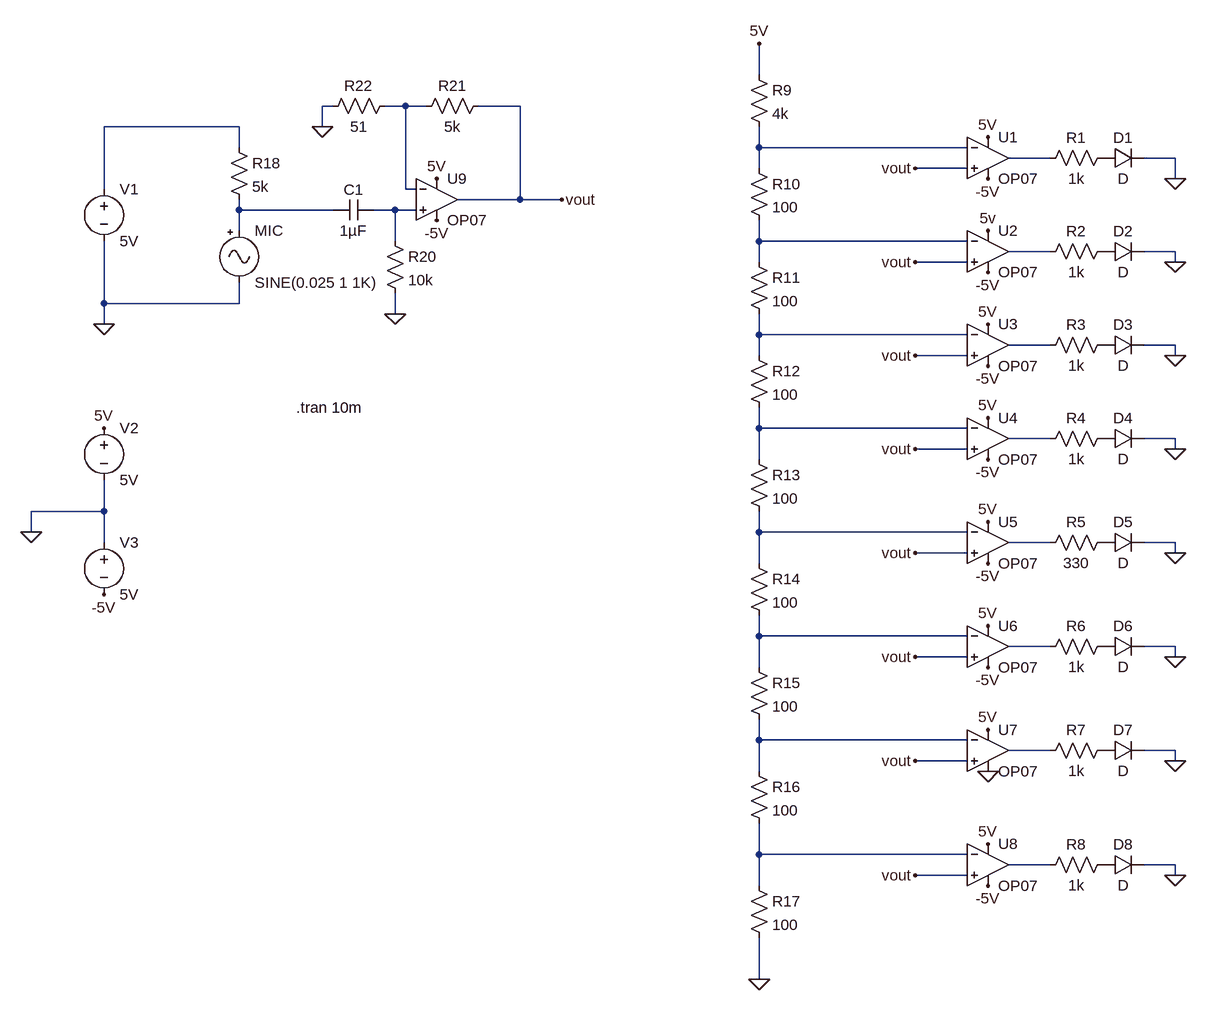
[diagram p0: schematic Project 1 - MIC.asc]
Project 1 - MIC.asc, the LTspice schematic file:
Version 4
SHEET 1 880 680
WIRE -272 -1120 -272 -1168
WIRE -928 -1072 -944 -1072
WIRE -816 -1072 -848 -1072
WIRE -784 -1072 -816 -1072
WIRE -640 -1072 -704 -1072
WIRE -1072 -1040 -1280 -1040
WIRE -944 -1040 -944 -1072
WIRE -1072 -1008 -1072 -1040
WIRE -272 -1008 -272 -1040
WIRE 48 -1008 -272 -1008
WIRE 176 -992 112 -992
WIRE 368 -992 320 -992
WIRE -272 -976 -272 -1008
WIRE 48 -976 -32 -976
WIRE 368 -960 368 -992
WIRE -1280 -944 -1280 -1040
WIRE -816 -944 -816 -1072
WIRE -800 -944 -816 -944
WIRE -640 -928 -640 -1072
WIRE -640 -928 -736 -928
WIRE -576 -928 -640 -928
WIRE -1072 -912 -1072 -928
WIRE -928 -912 -1072 -912
WIRE -832 -912 -864 -912
WIRE -800 -912 -832 -912
WIRE -1072 -880 -1072 -912
WIRE -832 -864 -832 -912
WIRE -272 -864 -272 -896
WIRE 48 -864 -272 -864
WIRE 176 -848 112 -848
WIRE 368 -848 320 -848
WIRE -272 -832 -272 -864
WIRE 48 -832 -32 -832
WIRE 368 -832 368 -848
WIRE -1280 -768 -1280 -864
WIRE -1072 -768 -1072 -800
WIRE -1072 -768 -1280 -768
WIRE -832 -752 -832 -784
WIRE -1280 -736 -1280 -768
WIRE -272 -720 -272 -752
WIRE 48 -720 -272 -720
WIRE 176 -704 112 -704
WIRE 368 -704 320 -704
WIRE -272 -688 -272 -720
WIRE 48 -688 -32 -688
WIRE 368 -688 368 -704
WIRE -272 -576 -272 -608
WIRE 48 -576 -272 -576
WIRE 176 -560 112 -560
WIRE 368 -560 320 -560
WIRE 48 -544 -32 -544
WIRE 368 -544 368 -560
WIRE -272 -528 -272 -576
WIRE -1280 -448 -1280 -496
WIRE -1280 -448 -1392 -448
WIRE -1392 -416 -1392 -448
WIRE -272 -416 -272 -448
WIRE 48 -416 -272 -416
WIRE -1280 -400 -1280 -448
WIRE 176 -400 112 -400
WIRE 368 -400 320 -400
WIRE 48 -384 -32 -384
WIRE 368 -384 368 -400
WIRE -272 -368 -272 -416
WIRE -272 -256 -272 -288
WIRE 48 -256 -272 -256
WIRE 176 -240 112 -240
WIRE 368 -240 320 -240
WIRE 48 -224 -32 -224
WIRE 368 -224 368 -240
WIRE -272 -208 -272 -256
WIRE -272 -96 -272 -128
WIRE 48 -96 -272 -96
WIRE 176 -80 112 -80
WIRE 368 -80 320 -80
WIRE 48 -64 -32 -64
WIRE 368 -64 368 -80
WIRE -272 -48 -272 -96
WIRE -272 80 -272 32
WIRE 48 80 -272 80
WIRE 176 96 112 96
WIRE 368 96 320 96
WIRE 48 112 -32 112
WIRE 368 112 368 96
WIRE -272 128 -272 80
WIRE -272 272 -272 208
FLAG 368 -960 0
FLAG 368 -832 0
FLAG 368 -688 0
FLAG 368 -544 0
FLAG 368 -384 0
FLAG 368 -224 0
FLAG 368 -64 0
FLAG 368 112 0
FLAG -272 272 0
FLAG -272 -1168 5V
FLAG 80 -1024 5V
FLAG 80 -880 5v
FLAG 80 -736 5V
FLAG 80 -592 5V
FLAG 80 -432 5V
FLAG 80 -272 5V
FLAG 80 -112 5V
FLAG 80 64 5V
FLAG 80 -960 -5V
FLAG 80 -816 -5V
FLAG 80 -672 -5V
FLAG 80 -528 -5V
FLAG 80 -368 -5V
FLAG 80 -208 -5V
FLAG 80 -48 0
FLAG 80 128 -5V
FLAG -32 -976 vout
FLAG -832 -752 0
FLAG -944 -1040 0
FLAG -576 -928 vout
FLAG -768 -960 5V
FLAG -768 -896 -5V
FLAG -1280 -736 0
FLAG -1280 -576 5V
FLAG -1280 -320 -5V
FLAG -1392 -416 0
FLAG -32 -832 vout
FLAG -32 -688 vout
FLAG -32 -544 vout
FLAG -32 -384 vout
FLAG -32 -224 vout
FLAG -32 -64 vout
FLAG -32 112 vout
SYMBOL OpAmps\\OP07 80 -1056 R0
SYMATTR InstName U1
SYMBOL OpAmps\\OP07 80 -912 R0
SYMATTR InstName U2
SYMBOL OpAmps\\OP07 80 -768 R0
SYMATTR InstName U3
SYMBOL OpAmps\\OP07 80 -624 R0
SYMATTR InstName U4
SYMBOL OpAmps\\OP07 80 -464 R0
SYMATTR InstName U5
SYMBOL OpAmps\\OP07 80 -304 R0
SYMATTR InstName U6
SYMBOL OpAmps\\OP07 80 -144 R0
SYMATTR InstName U7
SYMBOL OpAmps\\OP07 80 32 R0
SYMATTR InstName U8
SYMBOL res 272 -1008 R90
WINDOW 0 0 56 VBottom 2
WINDOW 3 32 56 VTop 2
SYMATTR InstName R1
SYMATTR Value 1k
SYMBOL res 272 -864 R90
WINDOW 0 0 56 VBottom 2
WINDOW 3 32 56 VTop 2
SYMATTR InstName R2
SYMATTR Value 1k
SYMBOL res 272 -720 R90
WINDOW 0 0 56 VBottom 2
WINDOW 3 32 56 VTop 2
SYMATTR InstName R3
SYMATTR Value 1k
SYMBOL res 272 -576 R90
WINDOW 0 0 56 VBottom 2
WINDOW 3 32 56 VTop 2
SYMATTR InstName R4
SYMATTR Value 1k
SYMBOL res 272 -416 R90
WINDOW 0 0 56 VBottom 2
WINDOW 3 32 56 VTop 2
SYMATTR InstName R5
SYMATTR Value 330
SYMBOL res 272 -256 R90
WINDOW 0 0 56 VBottom 2
WINDOW 3 32 56 VTop 2
SYMATTR InstName R6
SYMATTR Value 1k
SYMBOL res 272 -96 R90
WINDOW 0 0 56 VBottom 2
WINDOW 3 32 56 VTop 2
SYMATTR InstName R7
SYMATTR Value 1k
SYMBOL res 272 80 R90
WINDOW 0 0 56 VBottom 2
WINDOW 3 32 56 VTop 2
SYMATTR InstName R8
SYMATTR Value 1k
SYMBOL diode 256 -976 R270
WINDOW 0 32 32 VTop 2
WINDOW 3 0 32 VBottom 2
SYMATTR InstName D1
SYMBOL diode 256 -832 R270
WINDOW 0 32 32 VTop 2
WINDOW 3 0 32 VBottom 2
SYMATTR InstName D2
SYMBOL diode 256 -688 R270
WINDOW 0 32 32 VTop 2
WINDOW 3 0 32 VBottom 2
SYMATTR InstName D3
SYMBOL diode 256 -544 R270
WINDOW 0 32 32 VTop 2
WINDOW 3 0 32 VBottom 2
SYMATTR InstName D4
SYMBOL diode 256 -384 R270
WINDOW 0 32 32 VTop 2
WINDOW 3 0 32 VBottom 2
SYMATTR InstName D5
SYMBOL diode 256 -224 R270
WINDOW 0 32 32 VTop 2
WINDOW 3 0 32 VBottom 2
SYMATTR InstName D6
SYMBOL diode 256 -64 R270
WINDOW 0 32 32 VTop 2
WINDOW 3 0 32 VBottom 2
SYMATTR InstName D7
SYMBOL diode 256 112 R270
WINDOW 0 32 32 VTop 2
WINDOW 3 0 32 VBottom 2
SYMATTR InstName D8
SYMBOL res -288 -1136 R0
SYMATTR InstName R9
SYMATTR Value 4k
SYMBOL res -288 -992 R0
SYMATTR InstName R10
SYMATTR Value 100
SYMBOL res -288 -848 R0
SYMATTR InstName R11
SYMATTR Value 100
SYMBOL res -288 -704 R0
SYMATTR InstName R12
SYMATTR Value 100
SYMBOL res -288 -544 R0
SYMATTR InstName R13
SYMATTR Value 100
SYMBOL res -288 -384 R0
SYMATTR InstName R14
SYMATTR Value 100
SYMBOL res -288 -224 R0
SYMATTR InstName R15
SYMATTR Value 100
SYMBOL res -288 -64 R0
SYMATTR InstName R16
SYMATTR Value 100
SYMBOL res -288 112 R0
SYMATTR InstName R17
SYMATTR Value 100
SYMBOL voltage -1280 -960 R0
WINDOW 123 24 44 Left 2
WINDOW 39 0 0 Left 0
SYMATTR InstName V1
SYMATTR Value 5V
SYMBOL res -1088 -1024 R0
SYMATTR InstName R18
SYMATTR Value 5k
SYMBOL cap -864 -928 R90
WINDOW 0 0 32 VBottom 2
WINDOW 3 32 32 VTop 2
SYMATTR InstName C1
SYMATTR Value 1µF
SYMBOL OpAmps\\OP07 -768 -992 R0
SYMATTR InstName U9
SYMBOL res -848 -880 R0
SYMATTR InstName R20
SYMATTR Value 10k
SYMBOL res -688 -1088 R90
WINDOW 0 0 56 VBottom 2
WINDOW 3 32 56 VTop 2
SYMATTR InstName R21
SYMATTR Value 5k
SYMBOL res -832 -1088 R90
WINDOW 0 0 56 VBottom 2
WINDOW 3 32 56 VTop 2
SYMATTR InstName R22
SYMATTR Value 51
SYMBOL voltage -1280 -592 R0
WINDOW 123 24 44 Left 2
WINDOW 39 0 0 Left 0
SYMATTR InstName V2
SYMATTR Value 5V
SYMBOL voltage -1280 -416 R0
WINDOW 123 24 44 Left 2
WINDOW 39 0 0 Left 0
SYMATTR InstName V3
SYMATTR Value 5V
SYMBOL Misc\\signal -1072 -896 R0
SYMATTR InstName MIC
SYMATTR Value SINE(0.025 1 1K)
TEXT -984 -608 Left 2 !.tran 10m

The netlist it stands for:
* Project 1 - MIC.asc
XU1 vout N003 5V -5V N004 LT1001  ; OP07, pins In+ In- V+ V- OUT
XU2 vout N007 5V -5V N008 LT1001  ; OP07, pins In+ In- V+ V- OUT
XU3 vout N009 5V -5V N010 LT1001  ; OP07, pins In+ In- V+ V- OUT
XU4 vout N011 5V -5V N012 LT1001  ; OP07, pins In+ In- V+ V- OUT
XU5 vout N013 5V -5V N014 LT1001  ; OP07, pins In+ In- V+ V- OUT
XU6 vout N015 5V -5V N016 LT1001  ; OP07, pins In+ In- V+ V- OUT
XU7 vout N017 5V 0 N018 LT1001  ; OP07, pins In+ In- V+ V- OUT
XU8 vout N019 5V -5V N020 LT1001  ; OP07, pins In+ In- V+ V- OUT
R1 P001 N004 1k
R2 P002 N008 1k
R3 P003 N010 1k
R4 P004 N012 1k
R5 P005 N014 330
R6 P006 N016 1k
R7 P007 N018 1k
R8 P008 N020 1k
D1 P001 0 D
D2 P002 0 D
D3 P003 0 D
D4 P004 0 D
D5 P005 0 D
D6 P006 0 D
D7 P007 0 D
D8 P008 0 D
R9 5V N003 4k
R10 N003 N007 100
R11 N007 N009 100
R12 N009 N011 100
R13 N011 N013 100
R14 N013 N015 100
R15 N015 N017 100
R16 N017 N019 100
R17 N019 0 100
V1 N002 0 5V
R18 N002 N005 5k
C1 N006 N005 1µF
XU9 N006 N001 5V -5V vout LT1001  ; OP07, pins In+ In- V+ V- OUT
R20 N006 0 10k
R21 vout N001 5k
R22 N001 0 51
V2 5V 0 5V
V3 0 -5V 5V
V§MIC N005 0 SINE(0.025 1 1K)
.model D D
.lib standard.dio
.tran 10m
.lib LTC.lib
.backanno
.end